# EAGLE design MUV_gas_pcb (EAGLE 9.1.3)
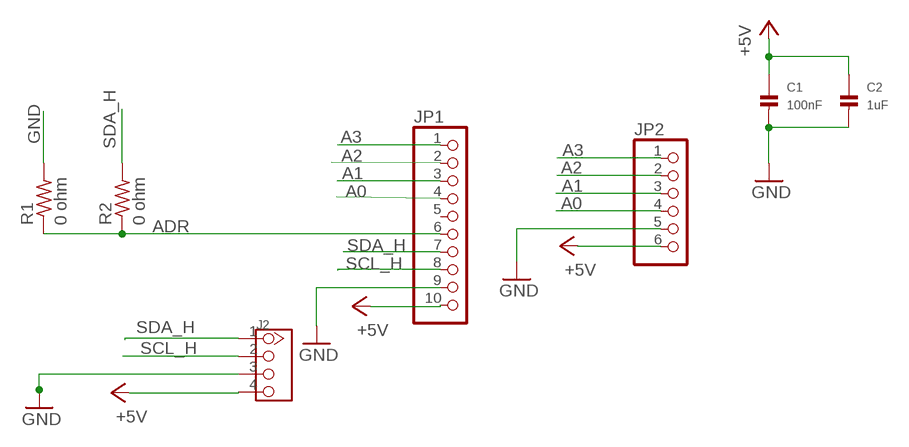
[diagram p0: schematic, sheet 1]

## Parts
C1  100nF  CAP_CERAMIC1206  [1206]
C2  1uF  CAP_CERAMIC1206  [1206]
J2  TWIG-4P-2.0-2.0  [4P-2.0]
JP1  HEADER-1X10  [1X10_OVAL]
JP2  HEADER-1X6  [1X06_OVAL]
R1  0 ohm  RESISTOR1206  [1206]
R2  0 ohm  RESISTOR1206  [1206]

## Nets
+5V: C1.1 C2.1 J2.4 JP1.10 JP2.6
A0: JP1.4 JP2.4
A1: JP1.3 JP2.3
A2: JP1.2 JP2.2
A3: JP1.1 JP2.1
ADR: JP1.6 R1.1 R2.1
GND: C1.2 C2.2 J2.3 JP1.9 JP2.5 R1.2
SCL_H: J2.2 JP1.8
SDA_H: J2.1 JP1.7 R2.2
Unconnected: JP1.5

## Library data of the parts
C1 C2 = microbuilder:CAP_CERAMIC: Ceramic Capacitors 0402 - 0402 Surface Mount Capacitors 16pF 50V 5% [Digikey: 445-4899-2-ND] 18pF 50V 5% [Digikey: 490-1281-2-ND] 22pF 50V 5% [Digikey: 490-1283-2-ND] 68pF 50V 5% [Digikey: 490-1289-2-ND] 0.1uF 10V 10% [Digikey: 490-1318-2-ND] 1.0uF 6.3V 10% [Digikey: 490-1320-2-ND] 0603 - 0603 Surface Mount Capacitors 16 pF 50V 5% [Digikey: 445-5051-2-ND] 22 pF 50V [Digikey: PCC220ACVTR-ND] 33 pF 50V 5% [Digikey: 490-1415-1-ND] 56pF 50V 5% [Digikey: 490-1421-1-ND] 220pF 50V 5% [Digikey: 445-1285-1-ND] 680 pF 50V 2200 pF 50V 5% C0G [Digikey: 445-1297-1-ND] 5600 pF 100V 5% X7R [Digikey: 478-3711-1-ND] 0.1 µF 25V 10% [Digikey: PCC2277TR-ND] 0.22 µF 16V 10% X7R [Digikey: 445-1318-1-ND] 1.0 µF 25V 10% [Digikey: 445-5146-2-ND] 0603 - RF Specific 3pF 250V +/-0.1pF RF [Digikey: 712-1347-1-ND] 18 pF 250V 5% [Digikey: 478-3505-1-ND or 712-1322-1-ND] 56 pF 250V 5% C0G RF [Digikey: 490-4867-1-ND] 68 pF 250V RF [Digikey: 490-4868-1-ND] 0805 - 0805 Surface Mount Capacitors 220 pF 250V 2% RF Ceramic Capacitor [Digikey: 712-1398-1-ND] 1000 pF 50V 2% NP0 Ceramic Capacitor [Digikey: 478-3760-1-ND] 0.1 µF 25V 10% Ceramic Capacitor [Digikey: PCC1828TR-ND] 1.0 µF 16V 10% Ceramic Capacitor[Digikey: 490-1691-2-ND] 10.0 µF 10V 10% Ceramic Capacitor[Digikey: 709-1228-1-ND] 10.0 uF 16V 10% Ceramic Capacitor [Digikey: 478-5165-2-ND] 47 uF 6.3V 20% Ceramic Capacitor [Digikey: 587-1779-1-ND or 399-5506-1-ND] 1206 - 1206 Surface Mount Capacitors 47uF 10V 20% Ceramic Capacitor [Digikey: 490-5528-1-ND or 399-5508-1-ND or 445-6010-1-ND] 100uF 6.3V -20%, +80% Y5V Ceramic Capacitor (Digikey: 490-4512-1-ND, Mouser: 81-GRM31CF50J107ZE1L)
J2 = Connector:TWIG-4P-2.0
JP1 = microbuilder:HEADER-1X10: PIN HEADER
JP2 = microbuilder:HEADER-1X6: PIN HEADER
R1 R2 = ng:RESISTOR

## Net classes
0 default: clearance 0.4 mm

## Board
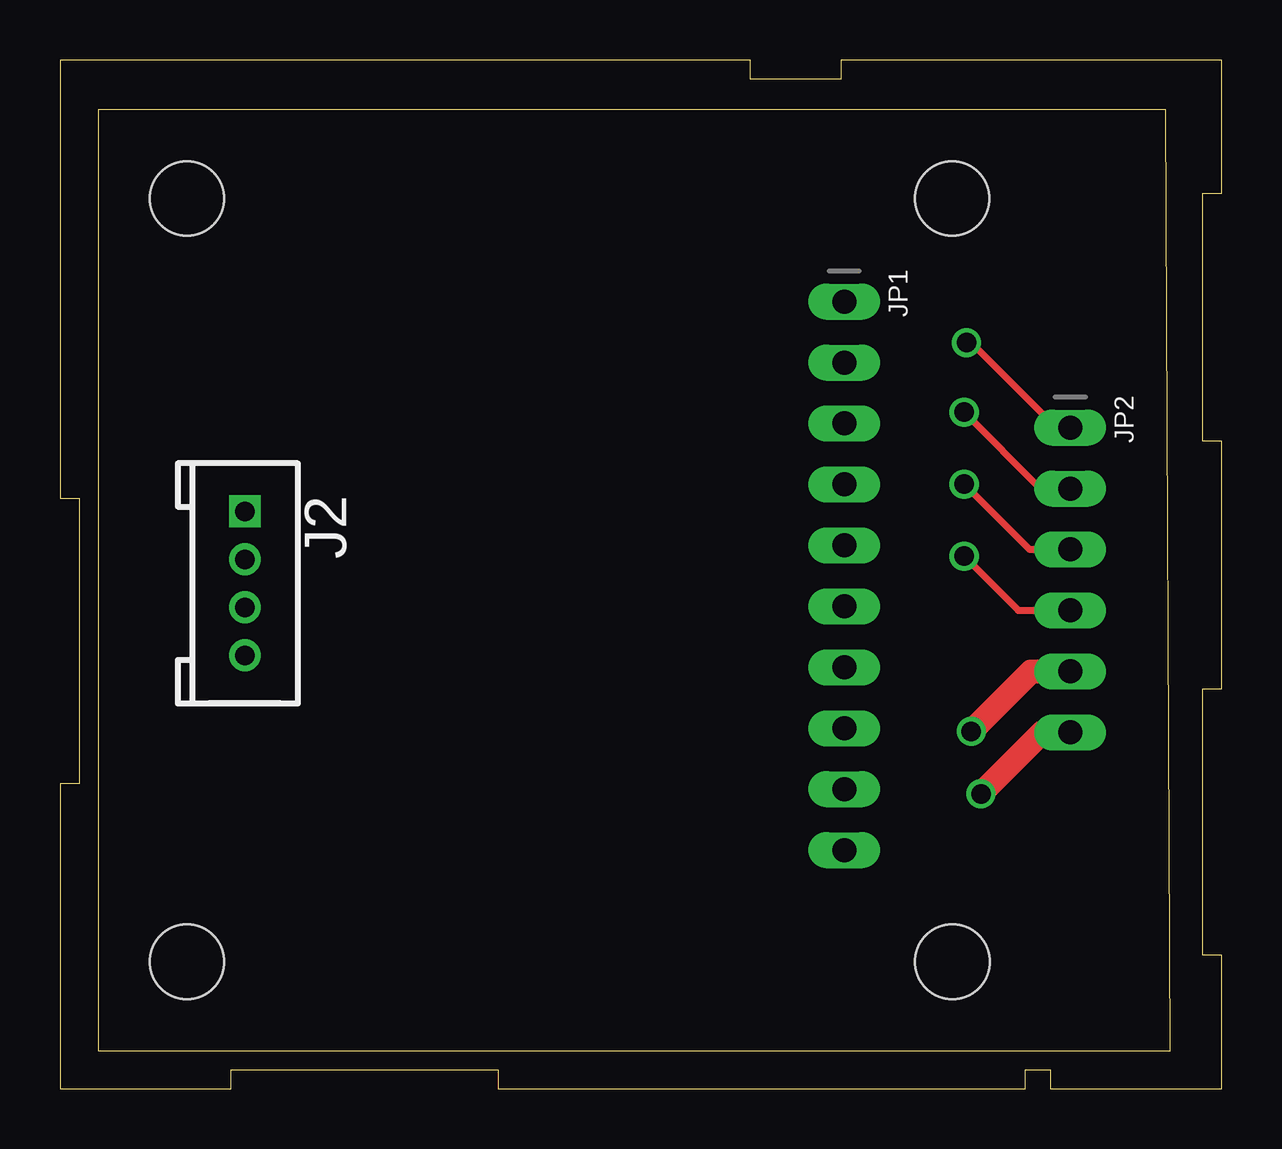
[diagram p1: board, top side]
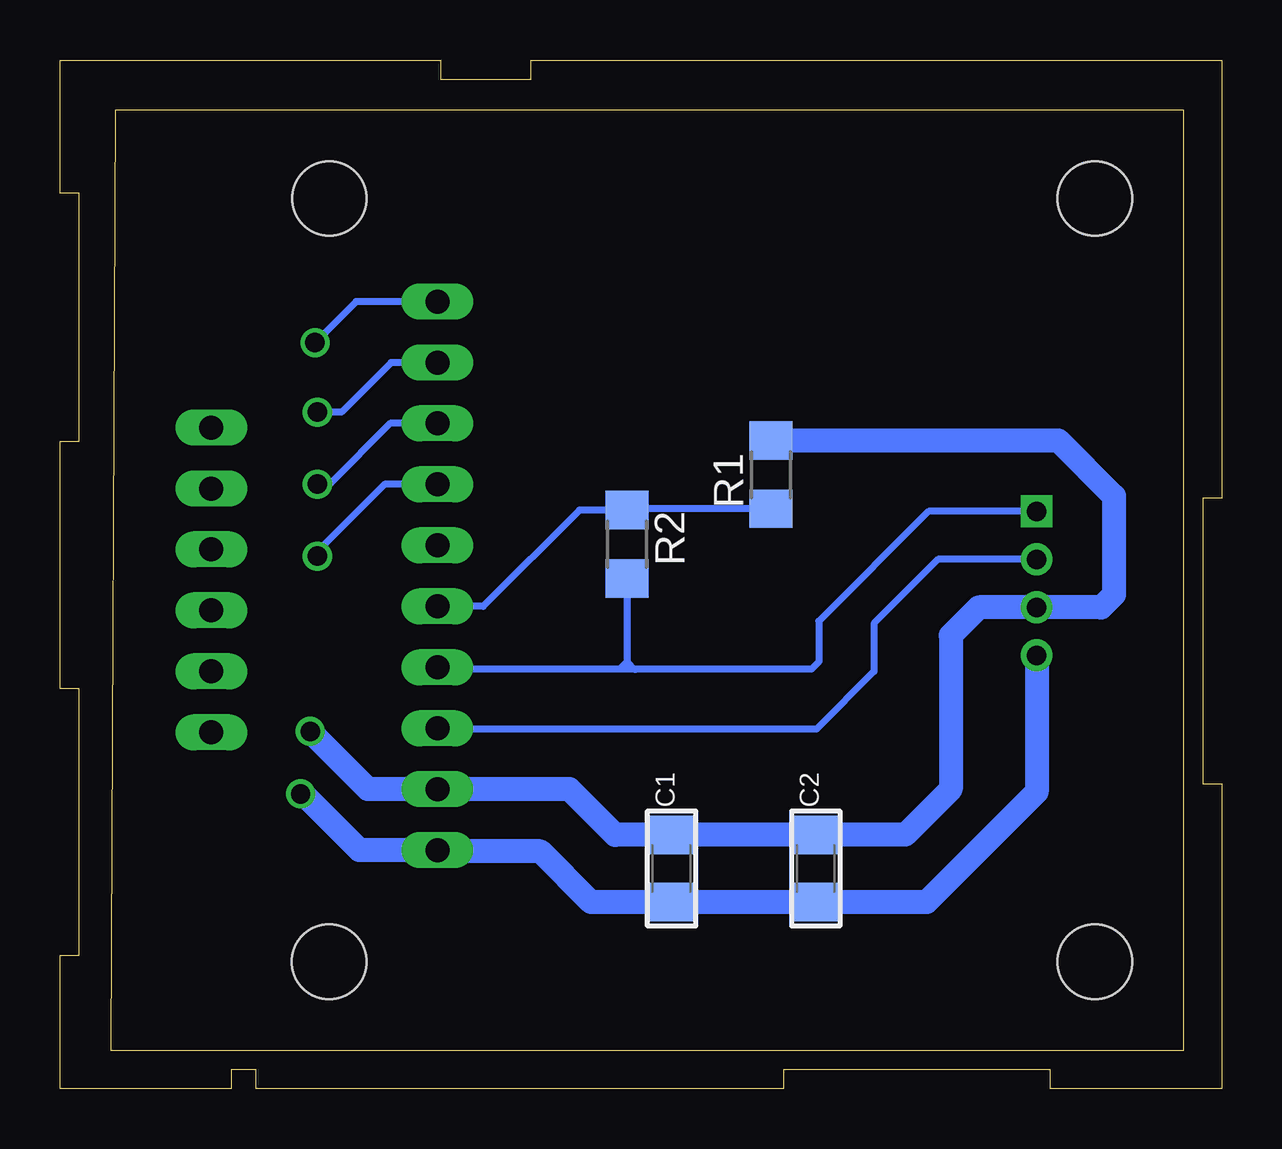
[diagram p2: board, bottom side, seen from below]

Size 48.42 x 42.86 mm. Coordinates in mm from the lower left corner, seen from the top.
Outline: 1.59,1.59 46.29,1.59 46.09,40.79 1.59,40.79 1.59,1.59
Outline: 0,0 7.14,0 7.14,0.79 18.26,0.79 18.26,0 40.24,0 40.24,0.79 41.28,0.79 41.28,0 48.42,0 48.42,5.56 47.63,5.56 47.63,16.67 48.42,16.67 48.42,26.99 47.63,26.99 47.63,37.31 48.42,37.31 48.42,42.86 32.54,42.86 32.54,42.07 28.79,42.07 28.79,42.86 0,42.86 0,24.61 0.79,24.61 0.79,12.7 0,12.7 0,0
Copper layers (1*16): Top 0.035mm / dielectric 1.5mm / Bottom 0.035mm
Design rules "default": minimum track width 6mil, minimum drill 0.35mm, track to track 6mil, track to pad 6mil, pad to pad 6mil, via to via 6mil, smd to smd 6mil, copper to edge 40mil, drill to drill 6mil, minimum pad ring 10mil, minimum via ring 8mil, stop-mask expansion 4mil, vias tented up to drill 0mil, thermal gap 10mil
Holes 3.1 mm at 37.19,37.09 5.29,37.09 37.19,5.29 5.29,5.29

### Footprints (pad centres in the part's own frame; a part is rotated, then mirrored left to right if it is on the bottom)
1206 = smd 1.6 x 1.8: 1 -1.4,0; 2 1.4,0
4P-2.0 = drill 0.813 pad 1.27 square: 1 -3,0 | drill 0.813 pad 1.27: 2 -1,0; 3 1,0; 4 3,0
1X10_OVAL = drill 1 long: 1 -11.43,0; 2 -8.89,0; 3 -6.35,0; 4 -3.81,0; 5 -1.27,0; 6 1.27,0; 7 3.81,0; 8 6.35,0; 9 8.89,0; 10 11.43,0
1X06_OVAL = drill 1 long: 1 -6.35,0; 2 -3.81,0; 3 -1.27,0; 4 1.27,0; 5 3.81,0; 6 6.35,0
1206' = smd 1.6 x 1.803: 1 -1.422,0; 2 1.422,0

### Placement (x,y rotation side)
C1  22.93,9.18 90 bottom
C2  16.92,9.18 90 bottom
J2  7.71,21.06 270 top
JP1  32.69,21.37 270 top
JP2  42.11,21.2 270 top
R1  0 ohm  [1206']  18.79,25.59 90 bottom
R2  0 ohm  [1206']  24.79,22.69 270 bottom

### Tracks (layer width: path | path; a pad name or v marks a point on that pad's centre or on a via)
+5V  (via drill 0.81)
  Top 1: v38.39,12.29 40.95,14.85 JP2.6
  Bottom 1: J2.4 7.71,12.37 12.3,7.78 C2.1 C1.1 26.28,7.78 28.39,9.89 32.64,9.89 JP1.10 35.94,9.94 38.29,12.29 v38.39,12.29
A0  (via drill 0.81)
  Top 0.3: v37.69,22.19 39.95,19.93 JP2.4
  Bottom 0.3: JP1.4 34.9,25.18 37.79,22.29 v37.69,22.19
A1  (via drill 0.81)
  Top 0.3: v37.69,25.19 40.41,22.47 JP2.3
  Bottom 0.3: JP1.3 34.66,27.72 37.19,25.19 v37.69,25.19
A2  (via drill 0.81)
  Top 0.3: v37.69,28.19 40.87,25.01 JP2.2
  Bottom 0.3: JP1.2 34.62,30.26 36.69,28.19 v37.69,28.19
A3  (via drill 0.81)
  Top 0.3: v37.79,31.09 37.99,31.09 41.53,27.55 JP2.1
  Bottom 0.3: JP1.1 36.08,32.8 v37.79,31.09
ADR
  Bottom 0.3: R1.1 24.73,24.17 R2.1 26.77,24.11 30.78,20.1 JP1.6
GND  (via drill 0.81)
  Top 1: v37.99,14.89 40.49,17.39 JP2.5
  Bottom 1: R1.2 6.81,27.01 4.49,24.69 4.49,20.59 5.02,20.06 J2.3 10.12,20.06 11.29,18.89 11.29,12.49 13.19,10.59 C2.2 C1.2 25.28,10.58 27.19,12.49 JP1.9 35.58,12.48 v37.99,14.89
SCL_H
  Bottom 0.3: J2.2 11.82,22.06 14.49,19.39 14.49,17.39 16.89,14.99 32.66,14.99 JP1.8
SDA_H
  Bottom 0.3: J2.1 12.22,24.06 16.79,19.49 16.79,17.79 17.09,17.49 24.39,17.49 24.49,17.49 | 24.49,17.49 25.09,17.49 | 25.09,17.49 32.62,17.49 JP1.7 | R2.2 24.79,17.79 | 24.79,17.79 25.09,17.49 | 24.79,17.79 24.49,17.49